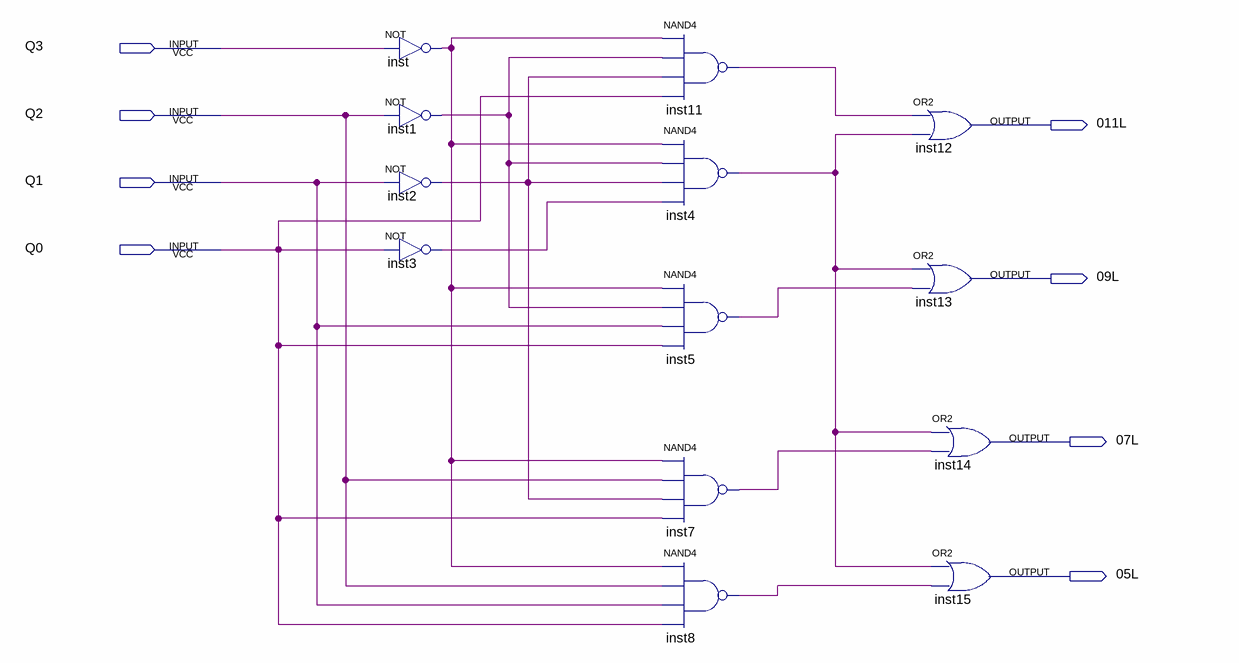
[diagram p0: schematic sheet]
// Quartus schematic LucesAmarillasInterOn.bdf as structural Verilog: 13 symbols, 8 pins
module LucesAmarillasInterOn (
  input  Q3,
  input  Q2,
  input  Q1,
  input  Q0,
  output \011L ,
  output \09L ,
  output \07L ,
  output \05L 
);

  wire inst1_out, inst2_out, inst3_out, inst4_out, inst5_out, inst7_out, inst8_out, inst11_out, inst_out;

  not inst (inst_out, Q3);
  not inst1 (inst1_out, Q2);
  not inst2 (inst2_out, Q1);
  not inst3 (inst3_out, Q0);
  nand inst11 (inst11_out, inst_out, inst1_out, inst2_out, Q0);
  nand inst4 (inst4_out, inst_out, inst1_out, inst2_out, inst3_out);
  nand inst5 (inst5_out, inst_out, inst1_out, Q1, Q0);
  nand inst7 (inst7_out, inst_out, Q2, inst2_out, Q0);
  nand inst8 (inst8_out, inst_out, Q2, Q1, Q0);
  or inst12 (\011L , inst11_out, inst4_out);
  or inst13 (\09L , inst4_out, inst5_out);
  or inst14 (\07L , inst4_out, inst7_out);
  or inst15 (\05L , inst4_out, inst8_out);
endmodule
